# EAGLE schematic GraphicsLCD (EAGLE 6.2)
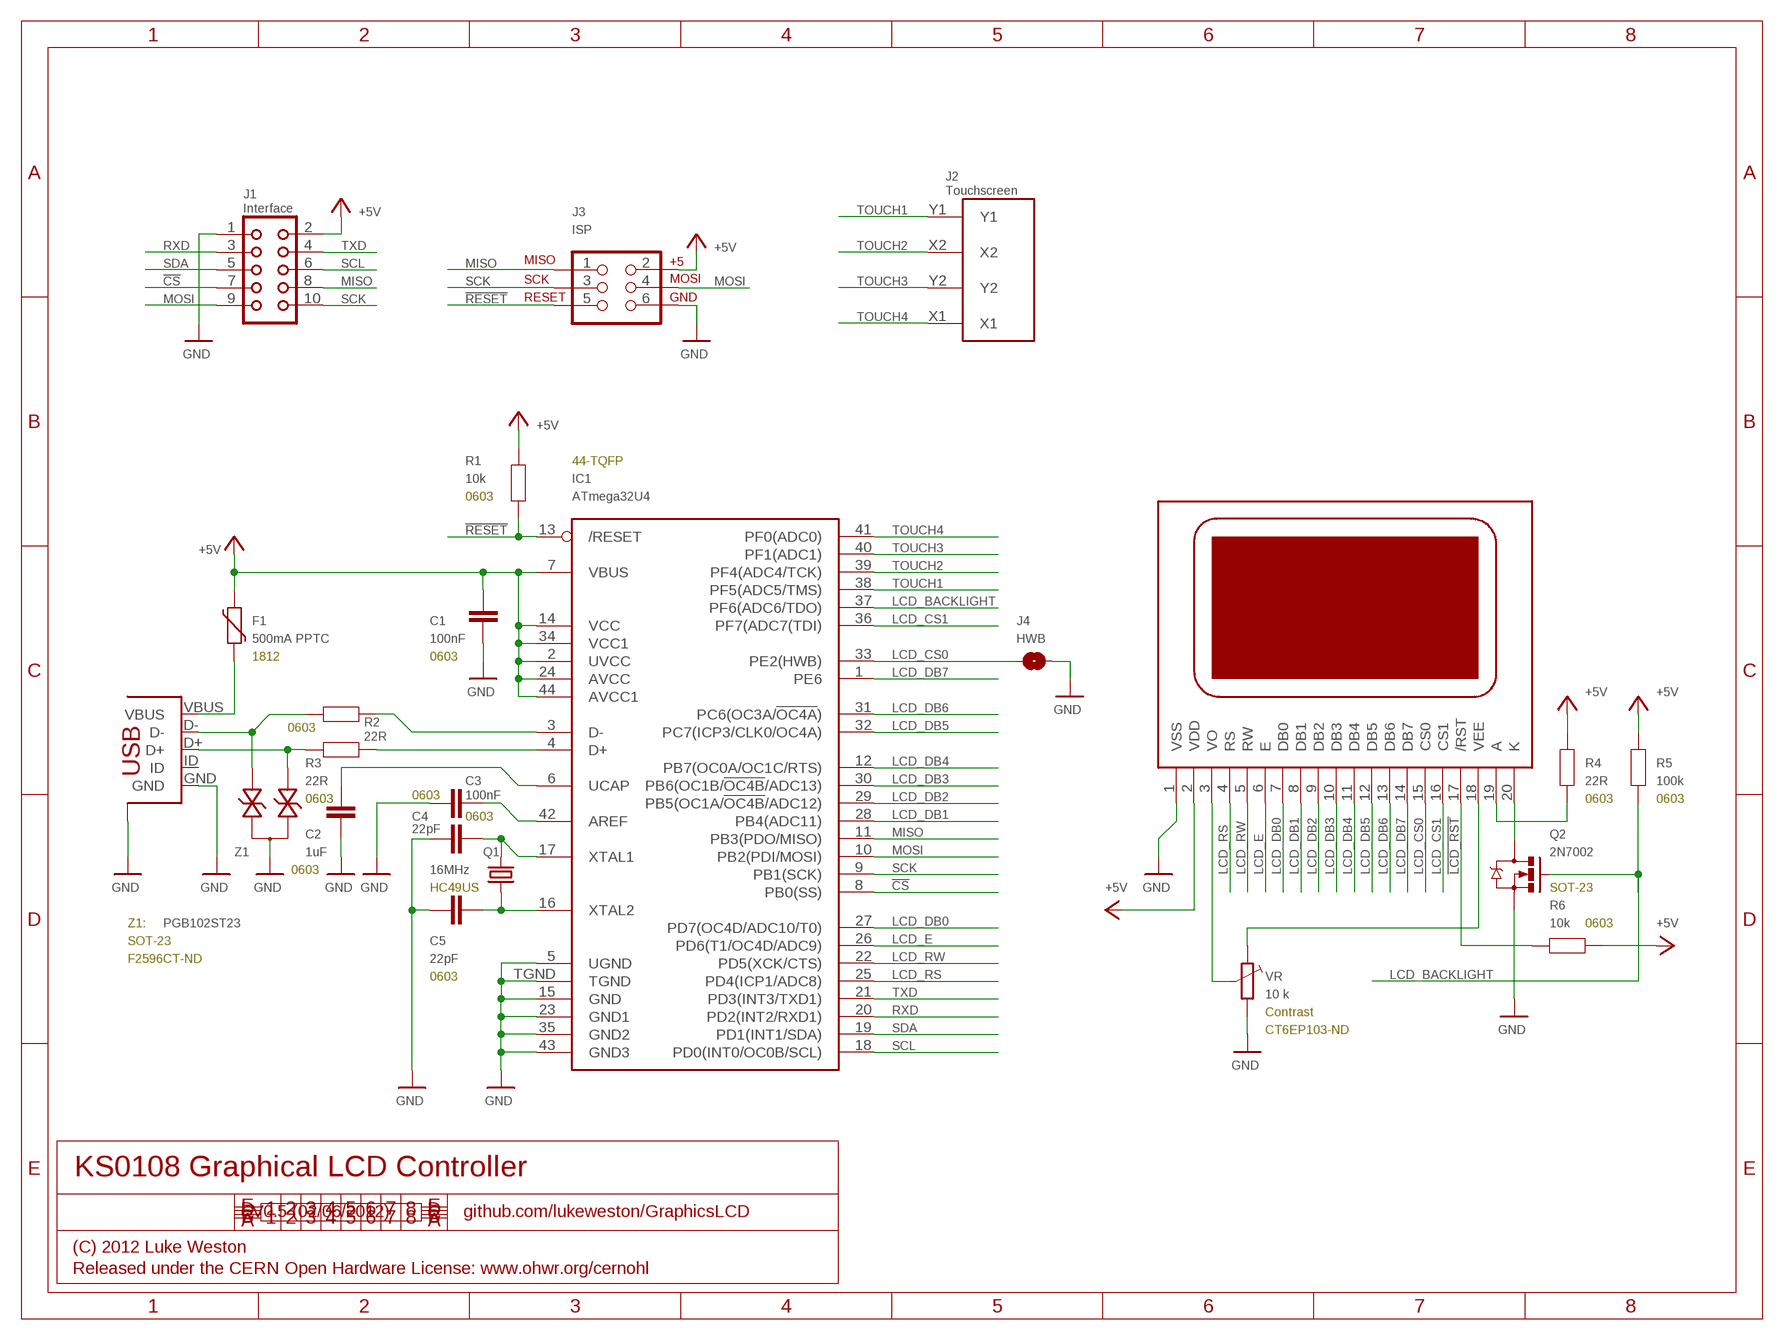
[diagram p0: schematic, sheet 1]

## Parts
C1  100nF  CAP0603  [0603]
C2  1uF  CAP0603  [0603]
C3  100nF  CAP0603  [0603]
C4  22pF  CAP0603  [0603]
C5  22pF  CAP0603  [0603]
F1  500mA PPTC  PTC  [1812]
IC1  ATmega32U4  ATMEGA32U4-QFN  [QFN-44N]
J1  Interface  CON10  [CON10]
J2  Touchscreen  DS_TOUCH_CONNECTOR  [DS_TOUCH_CONNECTOR]
J3  ISP  AVR_SPI_PRG_6NS  [2X3-NS]
J4  HWB  SJ  [SJ]
J5  USB-FT  [USB-MINIB-FT]
Q1  16MHz  CRYSTALHC49US  [HC49US]
Q2  2N7002  [SOT23-3]
R1  10k  RESISTOR0603  [0603]
R2  22R  RESISTOR0603  [0603]
R3  22R  RESISTOR0603  [0603]
R4  22R  RESISTOR0603  [0603]
R5  100k  RESISTOR0603  [0603]
R6  10k  RESISTOR0603  [0603]
U1  KS0108  TS12864A  [TS12864]
VR  10 k  TRIM_EU-CT6  [CT6]
Z1  PGB102ST23  [SOT23-3]

## Nets
!CS: IC1.8(PB0(SS)) J1.7
!LCD_RST: R6.1 U1.17(/RST)
!RESET: IC1.13(/RESET) J3.5 R1.1
+5V: C1.2 F1.2 IC1.2(UVCC) IC1.7(VBUS) IC1.14(VCC) IC1.24(AVCC) IC1.34(VCC1) IC1.44(AVCC1) J1.2 J3.2 R1.2 R4.2 R5.2 R6.2 U1.2(VDD)
A: R4.1 U1.19(A)
BACKLIGHT_K: Q2.3(D) U1.20(K)
GND: C1.1 C2.1 C3.1 C4.1 C5.1 IC1.5(UGND) IC1.15(GND) IC1.23(GND1) IC1.35(GND2) IC1.43(GND3) IC1.TGND J1.1 J3.6 J4.1 J5.GND J5.SH1(SH$1) J5.SH2(SH$1) J5.SH3(SH$1) J5.SH4(SH$1) Q2.2(S) U1.1(VSS) VR.A Z1.3
LCD_BACKLIGHT: IC1.37(PF6(ADC6/TDO)) Q2.1(G) R5.1
LCD_CS0: IC1.33(PE2(HWB)) J4.2 U1.15(CS0)
LCD_CS1: IC1.36(PF7(ADC7(TDI)) U1.16(CS1)
LCD_DB0: IC1.27(PD7(OC4D/ADC10/T0)) U1.7(DB0)
LCD_DB1: IC1.28(PB4(ADC11)) U1.8(DB1)
LCD_DB2: IC1.29(PB5(OC1A/!OC4B!/ADC12)) U1.9(DB2)
LCD_DB3: IC1.30(PB6(OC1B/!OC4B!/ADC13)) U1.10(DB3)
LCD_DB4: IC1.12(PB7(OC0A/OC1C/RTS)) U1.11(DB4)
LCD_DB5: IC1.32(PC7(ICP3/CLK0/OC4A)) U1.12(DB5)
LCD_DB6: IC1.31(PC6(OC3A/!OC4A!)) U1.13(DB6)
LCD_DB7: IC1.1(PE6) U1.14(DB7)
LCD_E: IC1.26(PD6(T1/OC4D/ADC9)) U1.6(E)
LCD_RS: IC1.25(PD4(ICP1/ADC8)) U1.4(RS)
LCD_RW: IC1.22(PD5(XCK/CTS)) U1.5(RW)
LCD_VO: U1.3(VO) VR.S
MISO: IC1.11(PB3(PDO/MISO)) J1.8 J3.1
MOSI: IC1.10(PB2(PDI/MOSI)) J1.9 J3.4
N$2: F1.1 J5.VBUS
N$11: C3.2 IC1.42(AREF)
N$28: C2.2 IC1.6(UCAP)
N$33: J5.D+ R3.2 Z1.1
N$34: J5.D- R2.2 Z1.2
N$35: C4.2 IC1.17(XTAL1) Q1.2
N$36: C5.2 IC1.16(XTAL2) Q1.1
N$37: IC1.4(D+) R3.1
N$38: IC1.3(D-) R2.1
RXD: IC1.20(PD2(INT2/RXD1)) J1.3
SCK: IC1.9(PB1(SCK)) J1.10 J3.3
SCL: IC1.18(PD0(INT0/OC0B/SCL)) J1.6
SDA: IC1.19(PD1(INT1/SDA)) J1.5
TOUCH1: IC1.38(PF5(ADC5/TMS)) J2.Y1
TOUCH2: IC1.39(PF4(ADC4/TCK)) J2.X2
TOUCH3: IC1.40(PF1(ADC1)) J2.Y2
TOUCH4: IC1.41(PF0(ADC0)) J2.X1
TXD: IC1.21(PD3(INT3/TXD1)) J1.4
VEE: U1.18(VEE) VR.E
Unconnected: J5.ID

## Notes on the sheet
- 44-TQFP
- 0603
- 1812 | 0603
- 0603
- 0603
- 0603 | 0603 | 0603
- 0603
- 0603
- HC49US | SOT-23
- Z1: | 0603
- SOT-23
- F2596CT-ND
- 0603
- Contrast
- CT6EP103-ND
- KS0108 Graphical LCD Controller
- V0.5 (02/06/2012) | github.com/lukeweston/GraphicsLCD
- (C) 2012 Luke Weston
- Released under the CERN Open Hardware License: www.ohwr.org/cernohl

## Library data of the parts
C1-C5 = freetronics:CAP: Capacitor Standard 0603 ceramic capacitor, and 0.1" leaded capacitor.
F1 = freetronics-luke:PTC: Polymeric PTC ("Polyfuse")
IC1 = freetronics-jon:ATMEGA32U4: ATMEGA32U4
J1 = con-harting:CON10: CONNECTOR; OC_FARNELL: unknown; OC_NEWARK: unknown
J2 = SparkFun:DS_TOUCH_CONNECTOR: 4-pin DS touch screen connector
J3 = SparkFun:AVR_SPI_PRG_6: AVR ISP 6 Pin This is the reduced ISP connector for AVR programming. Common on Arduino. This footprint will take up less PCB space and can be used with a 10-pin to 6-pin adapter such as SKU: BOB-08508
J4 = freetronics-luke:SJ: PCB "solder jumper". Note that there should nothing on the BOM corresponding to this "component".
J5 = freetronics-luke:USB-FT: 5-pin SMD USB mini-B. Same as Freetronics. (Turned off schematic pin labels on shield pins.)
Q1 = freetronics-master-v1:CRYSTAL: Crystals Various standard crystals. Proven footprints. Spark Fun Electronics SKU : COM-00534
Q2 = freetronics-luke:2N7002: 2N7002 N-ch MOSFET in SOT-23.
R1-R6 = freetronics-master-v1:RESISTOR: Resistor Basic schematic elements and footprints for 0603, 1206, and PTH 1/10th watt (small) resistors.
U1 = adafruit:TS12864A: KS0108 based display. Some have slightly different pinouts so double check!
VR = pot:TRIM_EU-: POTENTIOMETER
Z1 = freetronics-luke:PGB102ST23: Littelfuse PGB1 ESD transient suppressor in dual SOT-23 package. http://www.littelfuse.com/data/en/Data_Sheets/Littelfuse_PulseGuard-ESD_PGB1.pdf